# Altium project ArduinoNano_IoT_shield_MRF24J40MA.PrjPcb
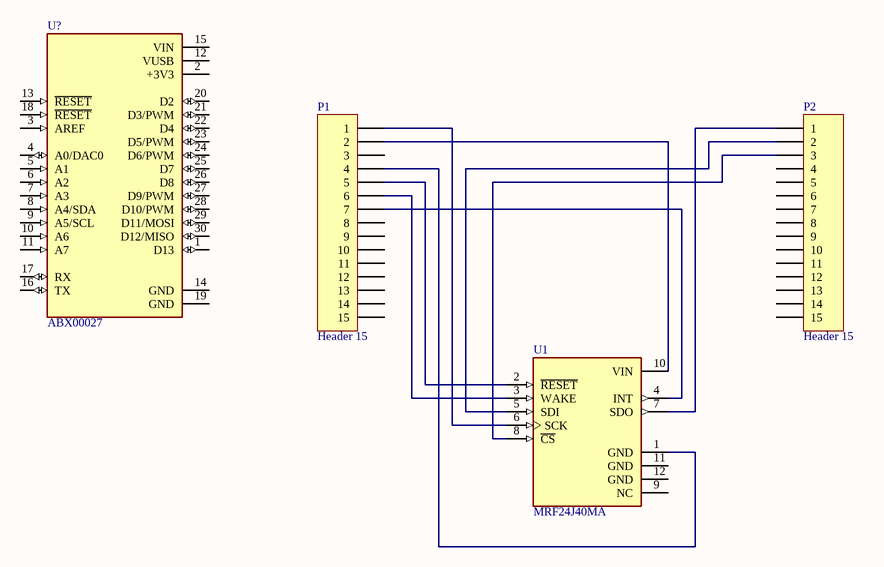
[diagram p0: MRF24J40MA_SHIELD.SchDoc]
1 sheet, 4 parts. Net scope: global (net labels, ports and power ports of the same name join across sheets).

## Sheet MRF24J40MA_SHIELD.SchDoc
size A

### Parts
P1  Header 15  [HDR1X15]
P2  Header 15  [HDR1X15]
U1  MRF24J40MA  [MODULE_MRF24J40MA]
U?  ABX00027  [MODULE_ABX00027]

### Nets
NetP1_1: P1.1 U1.6(SCK)
NetP1_2: P1.2 U1.10(VIN)
NetP1_4: P1.4 U1.1(GND)
NetP1_5: P1.5 U1.2(~{RESET})
NetP1_6: P1.6 U1.3(WAKE)
NetP1_7: P1.7 U1.4(INT)
NetP2_1: P2.1 U1.7(SDO)
NetP2_2: P2.2 U1.5(SDI)
NetP2_3: P2.3 U1.8(~{CS})

Not connected (* = marked no-connect by the designer): P1 3 8 9 10 11 12 13 14 15; P2 4 5 6 7 8 9 10 11 12 13 14 15; U1 9(NC) 11(GND) 12(GND); U? 1(D13) 2(+3V3) 3(AREF) 4(A0/DAC0) 5(A1) 6(A2) 7(A3) 8(A4/SDA) 9(A5/SCL) 10(A6) 11(A7) 12(VUSB) 13(~{RESET}) 14(GND) 15(VIN) 16(TX) 17(RX) 18(~{RESET}) 19(GND) 20(D2) 21(D3/PWM) 22(D4) 23(D5/PWM) 24(D6/PWM) 25(D7) 26(D8) 27(D9/PWM) 28(D10/PWM) 29(D11/MOSI) 30(D12/MISO)

### Library data of the parts
P1 P2 = Header 15: Header, 15-Pin; LatestRevisionDate: 17-Jul-2002; LatestRevisionNote: Re-released for DXP Platform.; Publisher: Altium Limited
U1 = MRF24J40MA: 802.15.4 Zigbee Transceiver Module 2.4GHz Integrated, Trace Surface Mount; MF: {'manufacturer': u'Microchip'}; MP: MRF24J40MA; Availability: Unavailable; Value: *; Package: None; Price: None
U? = ABX00027: ATSAMD21G18A Arduino Nano 33 IoT SAM D ARMÂ® CortexÂ®-M0+ MCU 32-Bit Embedded Evaluation Board; MF: {'manufacturer': u'Arduino'}; MP: ABX00027; Availability: Unavailable; Value: *; Package: None; Price: None